# Altium schematic sheet FPGA_FLASH.SchDoc
size 420 x 297 mm; SheetNumber: 27; SheetTotal: 27
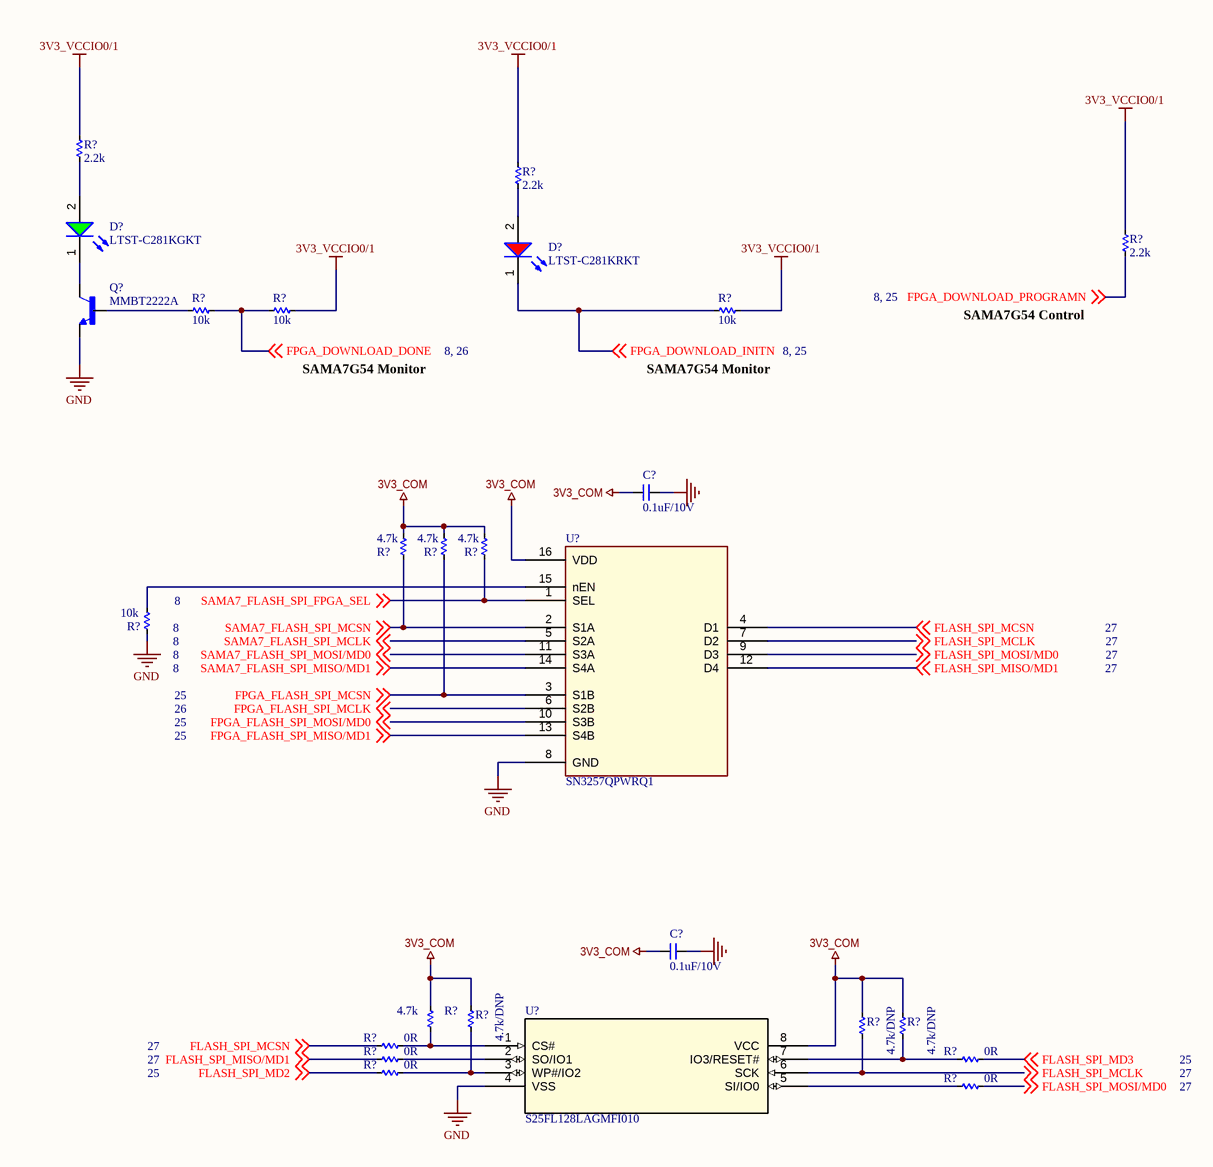
[diagram p0: FPGA_FLASH.SchDoc]

## Parts
(Parts that share a designator on the sheet are numbered #1, #2 ... from top to bottom, then left to right.)
C?#1  0.1uF/10V  [CAP_C_1005X50_L]
C?#2  0.1uF/10V  [CAP_C_1005X50_L]
D?#1  LTST-C281KGKT  [LED_0402]
D?#2  LTST-C281KRKT  [LED_0402]
Q?  MMBT2222A  [SOT95P240X120-3N]
R?#1  2.2k  [RES_C_1005x30_L]
R?#2  2.2k  [RES_C_1005x30_L]
R?#3  2.2k  [RES_C_1005x30_L]
R?#4  10k  [RES_C_1005x30_L]
R?#5  10k  [RES_C_1005x30_L]
R?#6  10k  [RES_C_1005x30_L]
R?#7  4.7k  [RES_C_1005x30_L]
R?#8  4.7k  [RES_C_1005x30_L]
R?#9  4.7k  [RES_C_1005x30_L]
R?#10  10k  [RES_C_1005x30_L]
R?#11  4.7k  [RES_C_1005x30_L]
R?#12  4.7k/DNP  [RES_C_1005x30_L]
R?#13  4.7k/DNP  [RES_C_1005x30_L]
R?#14  4.7k/DNP  [RES_C_1005x30_L]
R?#15  0R  [RES_C_1005x30_L]
R?#16  0R  [RES_C_1005x30_L]
R?#17  0R  [RES_C_1005x30_L]
R?#18  0R  [RES_C_1005x30_L]
R?#19  0R  [RES_C_1005x30_L]
U?#1  SN3257QPWRQ1  [SOIC_PRQ1_TEX]
U?#2  S25FL128LAGMFI010  [SOIC8_S25FL_CYP]

## Nets
3V3_COM: C?#1.2 C?#2.2 R?#7.2 R?#8.2 R?#9.2 R?#11.2 R?#12.2 R?#13.2 R?#14.2 U?#1.16(VDD) U?#2.8(VCC)
3V3_VCCIO0/1: R?#1.2 R?#2.2 R?#3.2 R?#5.1 R?#6.1
GND: C?#1.1 C?#2.1 Q?.2(E) R?#10.1 U?#1.8(GND) U?#2.4(VSS)
FLASH_SPI_MCLK: R?#13.1 U?#1.7(D2) U?#2.6(SCK) ; off-sheet FLASH_SPI_MCLK
FLASH_SPI_MCSN: R?#15.1 U?#1.4(D1) ; off-sheet FLASH_SPI_MCSN
FLASH_SPI_MD2: R?#18.1 ; off-sheet FLASH_SPI_MD2
FLASH_SPI_MD3: R?#17.2 ; off-sheet FLASH_SPI_MD3
FLASH_SPI_MISO/MD1: R?#16.1 U?#1.12(D4) ; off-sheet FLASH_SPI_MISO/MD1
FLASH_SPI_MOSI/MD0: R?#19.2 U?#1.9(D3) ; off-sheet FLASH_SPI_MOSI/MD0
FPGA_DOWNLOAD_DONE: R?#4.1 R?#5.2 ; off-sheet FPGA_DOWNLOAD_DONE
FPGA_DOWNLOAD_INITN: D?#2.1(K) R?#6.2 ; off-sheet FPGA_DOWNLOAD_INITN
FPGA_DOWNLOAD_PROGRAMN: R?#3.1 ; off-sheet FPGA_DOWNLOAD_PROGRAMN
FPGA_FLASH_SPI_MCLK: U?#1.6(S2B) ; off-sheet FPGA_FLASH_SPI_MCLK
FPGA_FLASH_SPI_MCSN: R?#8.1 U?#1.3(S1B) ; off-sheet FPGA_FLASH_SPI_MCSN
FPGA_FLASH_SPI_MISO/MD1: U?#1.13(S4B) ; off-sheet FPGA_FLASH_SPI_MISO/MD1
FPGA_FLASH_SPI_MOSI/MD0: U?#1.10(S3B) ; off-sheet FPGA_FLASH_SPI_MOSI/MD0
SAMA7_FLASH_SPI_FPGA_SEL: R?#9.1 U?#1.1(SEL) ; off-sheet SAMA7_FLASH_SPI_FPGA_SEL
SAMA7_FLASH_SPI_MCLK: U?#1.5(S2A) ; off-sheet SAMA7_FLASH_SPI_MCLK
SAMA7_FLASH_SPI_MCSN: R?#7.1 U?#1.2(S1A) ; off-sheet SAMA7_FLASH_SPI_MCSN
SAMA7_FLASH_SPI_MISO/MD1: U?#1.14(S4A) ; off-sheet SAMA7_FLASH_SPI_MISO/MD1
SAMA7_FLASH_SPI_MOSI/MD0: U?#1.11(S3A) ; off-sheet SAMA7_FLASH_SPI_MOSI/MD0
NetD?#1_1: D?#1.1(K) Q?.3(C)
NetD?#1_2: D?#1.2(A) R?#1.1
NetD?#2_2: D?#2.2(A) R?#2.1
NetQ?_1: Q?.1(B) R?#4.2
NetR?#10_2: R?#10.2 U?#1.15(nEN)
NetR?#11_1: R?#11.1 R?#15.2 U?#2.1(CS#)
NetR?#12_1: R?#12.1 R?#18.2 U?#2.3(WP#/IO2)
NetR?#14_1: R?#14.1 R?#17.1 U?#2.7(IO3/RESET#)
NetR?#16_2: R?#16.2 U?#2.2(SO/IO1)
NetR?#19_1: R?#19.1 U?#2.5(SI/IO0)

## Notes on the sheet
- SAMA7G54 Control
- SAMA7G54 Monitor
- (near R?#6) SAMA7G54 Monitor
- Project:
- Sub-system:
- Design by:
- Sheet title:
- Sheet
- A3
- of
- Checked by:
- Approved by:
- Revision:
- Document No:
- Size:
- Date:

## Library data of the parts
C?#1 C?#2 = _CAP_C_2: CAP
D?#1 = LED_GREEN: LED GREEN CLEAR 0402 SMD
D?#2 = LED_RED: LED RED CLEAR 0402 SMD
Q? = BJT_NPN_BEC: MF: Diotec Semiconductor; SnapEDA_Link: https://www.snapeda.com/parts/MMBT2222A/Diotec/view-part/?ref=snap; Package: SOT-23 Diotec; Value: *; MP: MMBT2222A; Check_prices: https://www.snapeda.com/parts/MMBT2222A/Diotec/view-part/?ref=eda
R?#1-R?#19 = _RES_B_2: RES
U?#1 = IC_SW_SPI_SN3257QPWRQ1: Automotive 5-V, 2:1 (SPDT), 4-channel switch with 1.8-V logic and powered-off protection 16-TSSOP -40 to 125; Manufacturer_Name: Texas Instruments; Copyright: Copyright (C) 2025 Ultra Librarian. All rights reserved.; Manufacturer_Part_Number: SN3257QPWRQ1; Datasheet: https://www.ti.com/lit/gpn/sn3257-q1; RefDes: RefDes; Type: Type
U?#2 = S25FL128LAGMFI010: Description; Manufacturer_Name: Cypress Semiconductor; Copyright: Copyright (C) 2025 Ultra Librarian. All rights reserved.; Manufacturer_Part_Number: S25FL128LAGMFI010; RefDes: RefDes; Type: Type